# Altium schematic sheet 800U-R3N3_V1.0.SchDoc
size Letter
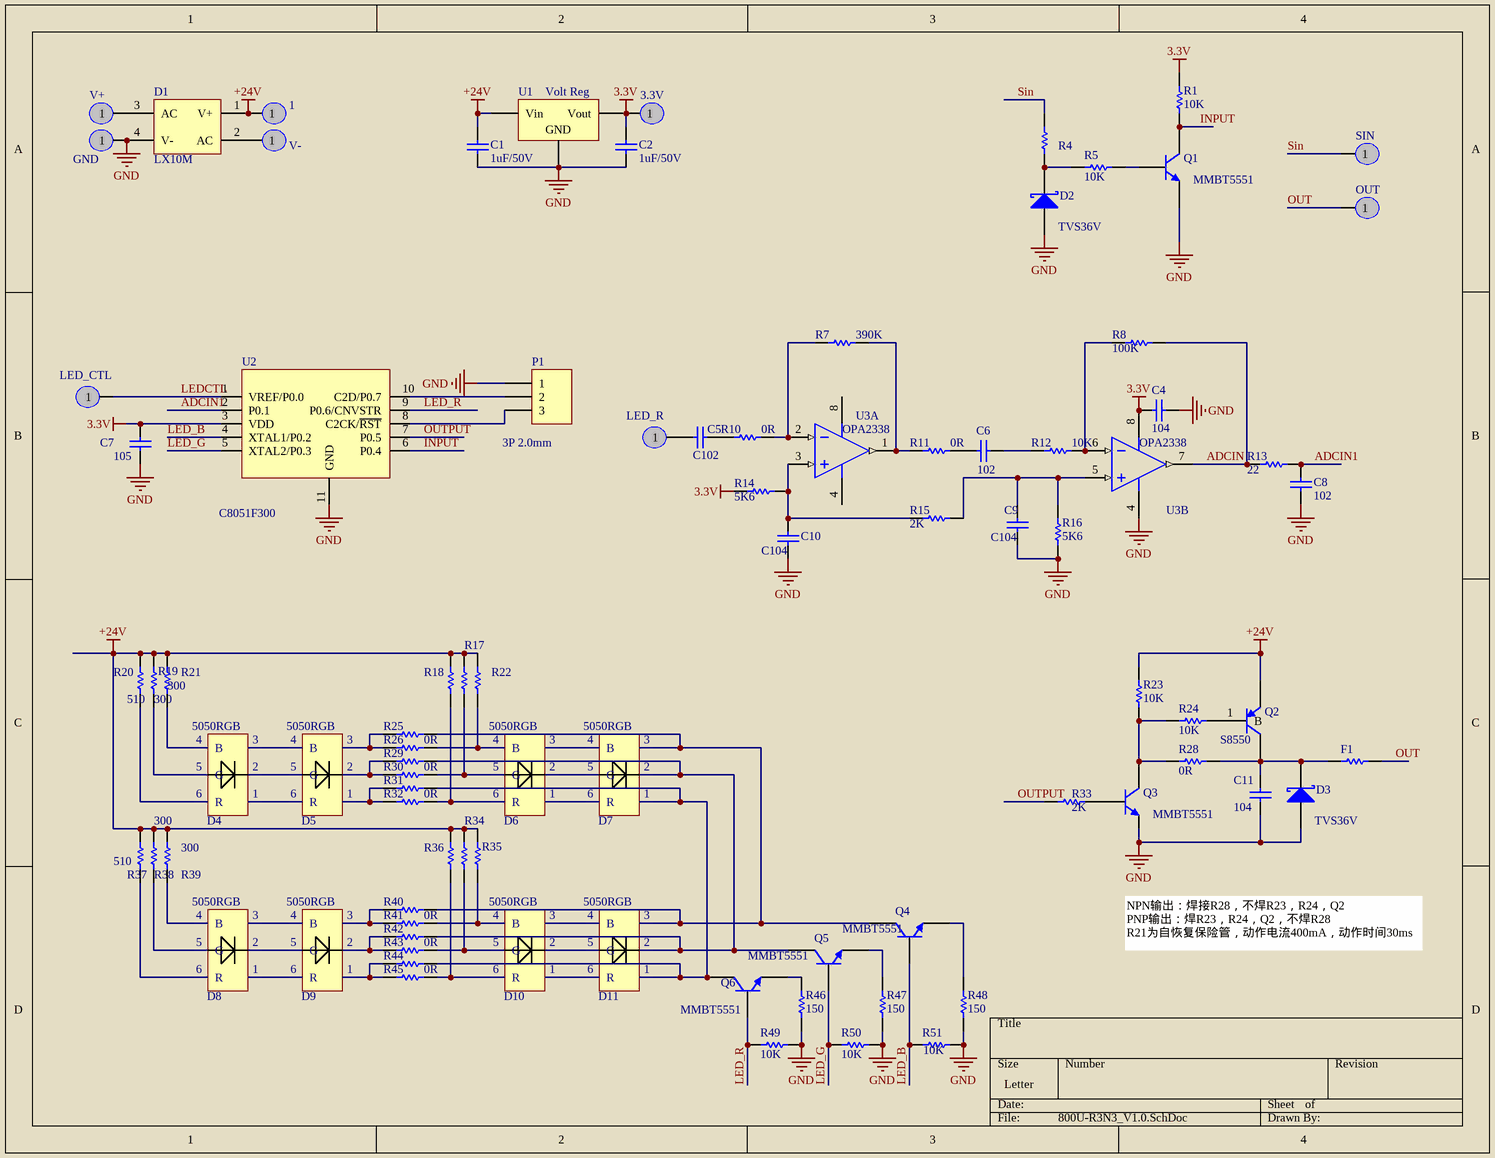
[diagram p0: 800U-R3N3_V1.0.SchDoc]

## Parts
1  (no value)  [HOLE_SMD]
3.3V  (no value)  [HOLE_SMD]
C1  1uF/50V  [C0603]
C2  1uF/50V  [C0603]
C4  value 104  [C0603]  (hidden comment: C106)
C5  value C102  [C0603]  (hidden comment: C104)
C6  value 102  [C0603]  (hidden comment: C104)
C7  105  [C0603]
C8  value 102  [C0603]  (hidden comment: C104)
C9  C104  [C0603]
C10  C104  [C0603]
C11  104  [C0603]
D1  LX10M  [桥堆 3.8*3.5]
D2  TVS36V  [HSMA]
D3  TVS36V  [HSMA]
D4  5050RGB  [5050RGB]
D5  5050RGB  [5050RGB]
D6  5050RGB  [5050RGB]
D7  5050RGB  [5050RGB]
D8  5050RGB  [5050RGB]
D9  5050RGB  [5050RGB]
D10  5050RGB  [5050RGB]
D11  5050RGB  [5050RGB]
F1  SMD1206P016  [1206]  (value not drawn)
GND  (no value)  [HOLE_SMD]
LED_CTL  (no value)  [HOLE_SMD]
LED_R  (no value)  [HOLE_SMD]
OUT  (no value)  [HOLE_SMD]
P1  3P 2.0mm  [SIP3]
Q1  MMBT5551  [SOT-23]
Q2  S8550  [SOT-23]
Q3  value MMBT5551  [SOT-23]  (hidden comment: 贴片三极管)
Q4  MMBT5551  [SOT-23]
Q5  MMBT5551  [SOT-23]
Q6  MMBT5551  [SOT-23]
R1  10K  [R0603]
R4  SMD1206P016  [R0603]  (value not drawn)
R5  10K  [R0603]
R7  (no value)  [R0603]
R8  (no value)  [R0603]
R10  (no value)  [R0603]
R11  (no value)  [R0603]
R12  (no value)  [R0603]
R13  (no value)  [R0603]
R14  (no value)  [R0603]
R15  (no value)  [R0603]
R16  (no value)  [R0603]
R17  (no value)  [2010]
R18  (no value)  [2010]
R19  300  [2010]
R20  510  [2010]
R21  300  [2010]
R22  (no value)  [2010]
R23  10K  [R0603]
R24  10K  [R0603]
R25  (no value)  [R0603]
R26  0R  [R0603]
R28  0R  [R0603]
R29  (no value)  [R0603]
R30  0R  [R0603]
R31  (no value)  [R0603]
R32  0R  [R0603]
R33  2K  [R0603]
R34  (no value)  [2010]
R35  (no value)  [2010]
R36  (no value)  [2010]
R37  510  [2010]
R38  300  [2010]
R39  300  [2010]
R40  (no value)  [R0603]
R41  0R  [R0603]
R42  (no value)  [R0603]
R43  0R  [R0603]
R44  (no value)  [R0603]
R45  0R  [R0603]
R46  150  [2010]
R47  150  [2010]
R48  150  [2010]
R49  10K  [R0603]
R50  10K  [R0603]
R51  10K  [R0603]
SIN  (no value)  [HOLE_SMD]
U1  Volt Reg  [SOT-23]
U2  C8051F300  [QFN-11]
U3  OPA2338  [SO-8]  (parts A,B of 2)
V+  (no value)  [HOLE_SMD]
V-  (no value)  [HOLE_SMD]

## Nets
3.3V: 3.3V.1 C2.1 C4.1 C7.1 R1.2 R14.1 U1.2(Vout) U2.3(VDD) U3.8(VCC)
+24V: 1.1 C1.1 D1.1(V+) Q2.2(E) R17.1 R18.1 R19.1 R20.1 R21.1 R22.1 R23.2 R34.1 R35.1 R36.1 R37.1 R38.1 R39.1 U1.3(Vin)
GND: C1.2 C2.2 C4.2 C7.2 C8.1 C9.2 C10.2 C11.2 D1.4(V-) D2.1(A) D3.1(A) GND.1 P1.1 Q1.2(E) Q3.2(E) R16.1 R46.2 R47.2 R48.2 R49.2 R50.2 R51.2 U1.1(GND) U2.11(GND) U3.4(VEE)
ADCIN: R8.2 R13.1 U3.7(OUT)
ADCIN1: C8.2 R13.2 U2.2(P0.1)
INPUT: Q1.3(C) R1.1 U2.6(P0.4)
LED_B: Q4.1(B) R51.1 U2.4(XTAL1/P0.2)
LED_G: Q5.1(B) R50.1 U2.5(XTAL2/P0.3)
LED_R: Q6.1(B) R49.1 U2.9(P0.6/CNVSTR)
LEDCTL: LED_CTL.1 U2.1(VREF/P0.0)
OUT: F1.2 OUT.1
OUTPUT: R33.2 U2.7(P0.5)
Sin: R4.2 SIN.1
NetC5_1: C5.1 LED_R.1
NetC5_2: C5.2 R10.1
NetC6_1: C6.1 R11.2
NetC6_2: C6.2 R12.1
NetC9_1: C9.1 R15.2 R16.2 U3.5(IN+)
NetC10_1: C10.1 R14.2 R15.1 U3.3(IN+)
NetC11_1: C11.1 D3.2(K) F1.1 Q2.3(C) R28.2
NetD1_2: D1.2(AC) V-.1
NetD1_3: D1.3(AC) V+.1
NetD2_2: D2.2(K) R4.1 R5.1
NetD4_1: D4.1 D5.6(R)
NetD4_2: D4.2 D5.5(G)
NetD4_3: D4.3 D5.4(B)
NetD4_4: D4.4(B) R21.2
NetD4_5: D4.5(G) R19.2
NetD4_6: D4.6(R) R20.2
NetD5_1: D5.1 R31.1 R32.1
NetD5_2: D5.2 R29.1 R30.1
NetD5_3: D5.3 R25.1 R26.1
NetD6_1: D6.1 D7.6(R)
NetD6_2: D6.2 D7.5(G)
NetD6_3: D6.3 D7.4(B)
NetD6_4: D6.4(B) R22.2 R26.2
NetD6_5: D6.5(G) R17.2 R30.2
NetD6_6: D6.6(R) R18.2 R32.2
NetD7_1: D7.1 D11.1 Q6.3(C) R31.2 R44.2
NetD7_2: D7.2 D11.2 Q5.3(C) R29.2 R42.2
NetD7_3: D7.3 D11.3 Q4.3(C) R25.2 R40.2
NetD8_1: D8.1 D9.6(R)
NetD8_2: D8.2 D9.5(G)
NetD8_3: D8.3 D9.4(B)
NetD8_4: D8.4(B) R39.2
NetD8_5: D8.5(G) R38.2
NetD8_6: D8.6(R) R37.2
NetD9_1: D9.1 R44.1 R45.1
NetD9_2: D9.2 R42.1 R43.1
NetD9_3: D9.3 R40.1 R41.1
NetD10_1: D10.1 D11.6(R)
NetD10_2: D10.2 D11.5(G)
NetD10_3: D10.3 D11.4(B)
NetD10_4: D10.4(B) R35.2 R41.2
NetD10_5: D10.5(G) R34.2 R43.2
NetD10_6: D10.6(R) R36.2 R45.2
NetP1_2: P1.2 U2.10(C2D/P0.7)
NetP1_3: P1.3 U2.8(C2CK/~{RST})
NetQ1_1: Q1.1(B) R5.2
NetQ2_1: Q2.1(B) R24.2
NetQ3_1: Q3.1(B) R33.1
NetQ3_3: Q3.3(C) R23.1 R24.1 R28.1
NetQ4_2: Q4.2(E) R48.1
NetQ5_2: Q5.2(E) R47.1
NetQ6_2: Q6.2(E) R46.1
NetR7_1: R7.1 R10.2 U3.2(IN-)
NetR7_2: R7.2 R11.1 U3.1(OUT)
NetR8_1: R8.1 R12.2 U3.6(IN-)

## Notes on the sheet
- NPN输出：焊接R28，不焊R23，R24，Q2
  PNP输出：焊R23，R24，Q2，不焊R28
  R21为自恢复保险管，动作电流400mA，动作时间30ms
- (in symbol Res Semi) 0R; 390K; 5K6; 2K; 10K; 100K; 22

## Library data of the parts
1 3.3V GND LED_CTL LED_R OUT SIN V+ V- = 焊盘
C1 C2 C7 C11 = Cap: 贴片电容; Published: 8-Jun-2000; LatestRevisionDate: 17-Jul-2002; LatestRevisionNote: Re-released for DXP Platform.; PackageReference: RAD-0.3; Publisher: Altium Limited
  C1 C2: PackageDescription: Radial Cap, Thru-Hole; 2 Leads; 0.3 in Pin Spacing; Value: 1uF/50V
  C7: Value: 105
  C11: Value: 104
C4-C6 C8-C10 = Cap: Capacitor; Published: 8-Jun-2000; LatestRevisionDate: 17-Jul-2002; LatestRevisionNote: Re-released for DXP Platform.; PackageReference: RAD-0.3; Publisher: Altium Limited
  C9 C10: Value: C104
D1 = Bridge2: 贴片桥堆; Value: LX10M
D2 D3 = D Schottky: 贴片TVS; Published: 8-Jun-2000; LatestRevisionDate: 17-Jul-2002; LatestRevisionNote: Re-released for DXP Platform.; PackageReference: SMB; Publisher: Altium Limited; Code_JEDEC: DO-214-AA; Value: TVS36V
D4-D11 = 5050RGB: 贴片RBG发光管; Value: 5050RGB
F1 R4 R7 R8 R10-R16 = Res Semi: Semiconductor Resistor
  F1 R4: Published: 8-Jun-2000; LatestRevisionDate: 17-Jul-2002; LatestRevisionNote: Re-released for DXP Platform.; PackageReference: AXIAL-0.5; Publisher: Altium Limited
P1 = MHDR1X3: 插座; LatestRevisionDate: 17-Jul-2002; LatestRevisionNote: Re-released for DXP Platform.; Publisher: Altium Limited; Value: 3P 2.0mm
Q1 Q4-Q6 = NPN: 贴片NPN三极管; Value: MMBT5551
Q2 = S8550: 贴片PNP三极管; Value: S8550
Q3 = NPN: NPN三极管
R1 R5 R17-R26 R28-R51 = Res Semi: 贴片电阻
  R1 R5 R23 R24 R49-R51: Value: 10K
  R19 R21 R38 R39: Value: 300
  R20 R37: Value: 510
  R26 R28 R30 R32 R41 R43 R45: Value: 0R
  R33: Value: 2K
  R46-R48: Value: 150
U1 = Volt Reg: Voltage Regulator; Published: 24-Mar-1999; LatestRevisionDate: 17-Jul-2002; LatestRevisionNote: Re-released for DXP Platform.; PackageReference: D2PAK; Publisher: Altium Limited; Code_JEDEC: SMD-220
U2 = PIC16C505: 贴片芯片; Value: C8051F300
U3 = LM833D: Dual Low Noise, Audio Amplifier; Published: 17-Jul-2002; LatestRevisionDate: 13-Apr-2006; LatestRevisionNote: IPC-7351 Footprint Added.; DatasheetVersion: 1996; PackageVersion: 1996; PackageReference: 751-05; Publisher: Altium Limited; PackageDescription: 8-Pin Small Outline Integrated Circuit 1.27 mm Pitch; Code_JEDEC: MS-012-AA; Code_IPC: SOIC127P600-8; ComponentLink1Description: Datasheet; ComponentLink1URL: http://www.onsemi.com/pub/Collateral/LM833-D.PDF